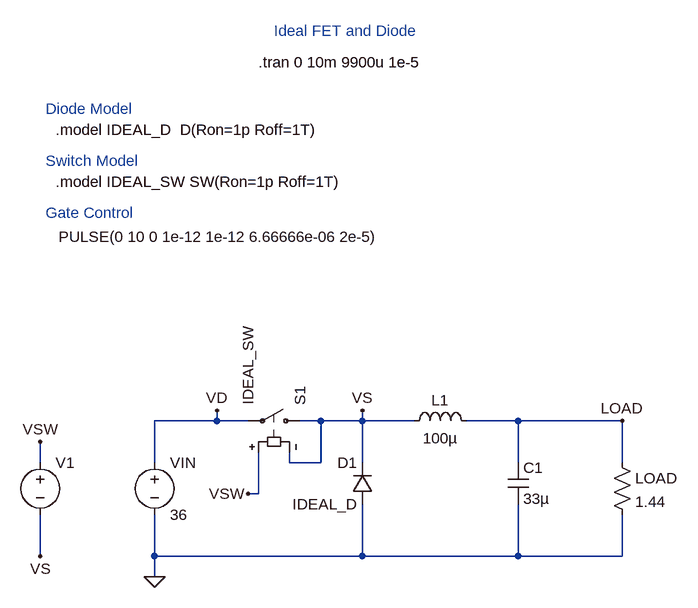
[diagram p0: schematic buck.asc]
buck.asc, the LTspice schematic file:
Version 4
SHEET 1 1032 680
WIRE 288 64 288 48
WIRE 288 64 192 64
WIRE 336 64 288 64
WIRE 448 64 416 64
WIRE 512 64 512 48
WIRE 512 64 448 64
WIRE 592 64 512 64
WIRE 752 64 672 64
WIRE 912 64 752 64
WIRE 16 128 16 96
WIRE 192 128 192 64
WIRE 400 128 400 112
WIRE 448 128 448 64
WIRE 448 128 400 128
WIRE 512 128 512 64
WIRE 752 128 752 64
WIRE 912 128 912 64
WIRE 352 176 352 112
WIRE 352 176 336 176
WIRE 16 272 16 208
WIRE 192 272 192 208
WIRE 512 272 512 192
WIRE 512 272 192 272
WIRE 752 272 752 192
WIRE 752 272 512 272
WIRE 912 272 912 208
WIRE 912 272 752 272
WIRE 192 304 192 272
FLAG 336 176 VSW
FLAG 192 304 0
FLAG 512 48 VS
FLAG 16 272 VS
FLAG 16 96 VSW
FLAG 912 64 LOAD
FLAG 288 48 VD
SYMBOL voltage 192 112 R0
WINDOW 123 0 0 Left 0
WINDOW 39 0 0 Left 0
SYMATTR InstName VIN
SYMATTR Value 36
SYMBOL ind 576 80 R270
WINDOW 0 32 56 VTop 2
WINDOW 3 5 56 VBottom 2
SYMATTR InstName L1
SYMATTR Value 100µ
SYMBOL cap 736 128 R0
SYMATTR InstName C1
SYMATTR Value 33µ
SYMBOL diode 528 192 R180
WINDOW 0 24 64 Left 2
WINDOW 3 24 0 Left 2
SYMATTR InstName D1
SYMATTR Value IDEAL_D
SYMBOL res 896 112 R0
SYMATTR InstName LOAD
SYMATTR Value 1.44
SYMBOL voltage 16 112 R0
WINDOW 3 28 -331 Left 2
WINDOW 123 0 0 Left 0
WINDOW 39 0 0 Left 0
SYMATTR Value PULSE(0 10 0 1e-12 1e-12 6.66666e-06 2e-5)
SYMATTR InstName V1
SYMBOL sw 432 64 M270
SYMATTR InstName S1
SYMATTR Value IDEAL_SW
TEXT 352 -488 Left 2 !.tran 0 10m 9900u 1e-5
TEXT 40 -304 Left 2 !.model IDEAL_SW SW(Ron=1p Roff=1T)
TEXT 376 -536 Left 2 ;Ideal FET and Diode
TEXT 24 -256 Left 2 ;Gate Control
TEXT 24 -336 Left 2 ;Switch Model
TEXT 40 -384 Left 2 !.model IDEAL_D  D(Ron=1p Roff=1T)
TEXT 24 -416 Left 2 ;Diode Model

The netlist it stands for:
* buck.asc
VIN VD 0 36
L1 VS LOAD 100µ
C1 LOAD 0 33µ
D1 0 VS IDEAL_D
R§LOAD LOAD 0 1.44
V1 VSW VS PULSE(0 10 0 1e-12 1e-12 6.66666e-06 2e-5)
S1 VS VD VSW VS IDEAL_SW
.model D D
.lib standard.dio
.tran 0 10m 9900u 1e-5
.model IDEAL_SW SW(Ron=1p Roff=1T)
* Ideal FET and Diode
* Gate Control
* Switch Model
.model IDEAL_D  D(Ron=1p Roff=1T)
* Diode Model
.backanno
.end

* Results of the author's LTspice run, read from the files saved beside the schematic
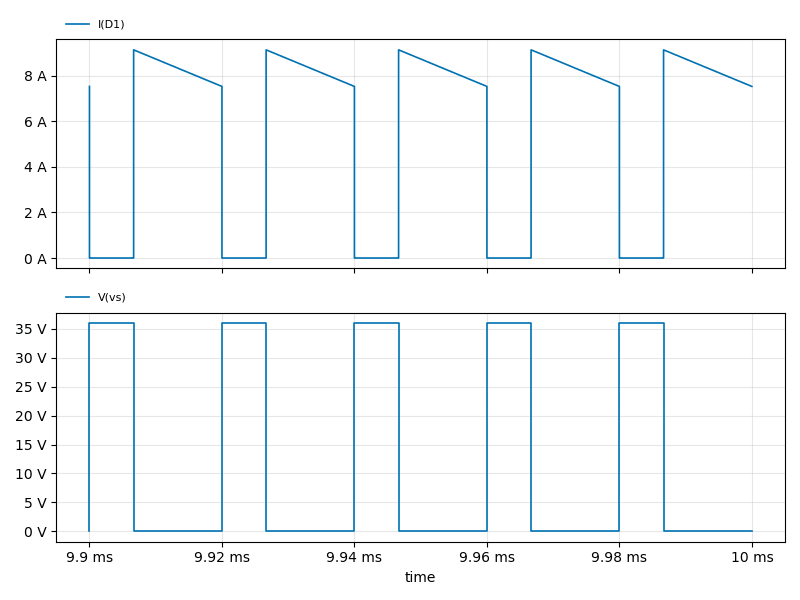
[diagram p1: Transient Analysis of buck.asc, plotted from the saved traces]
* Transient Analysis, 1 run:
*   I(D1): min 0 A, max 9.129 A, average 5.552 A, rms 6.811 A, last 7.526 A
*   V(vs): min 0 V, max 36 V, average 12 V, rms 20.78 V, last 0 V